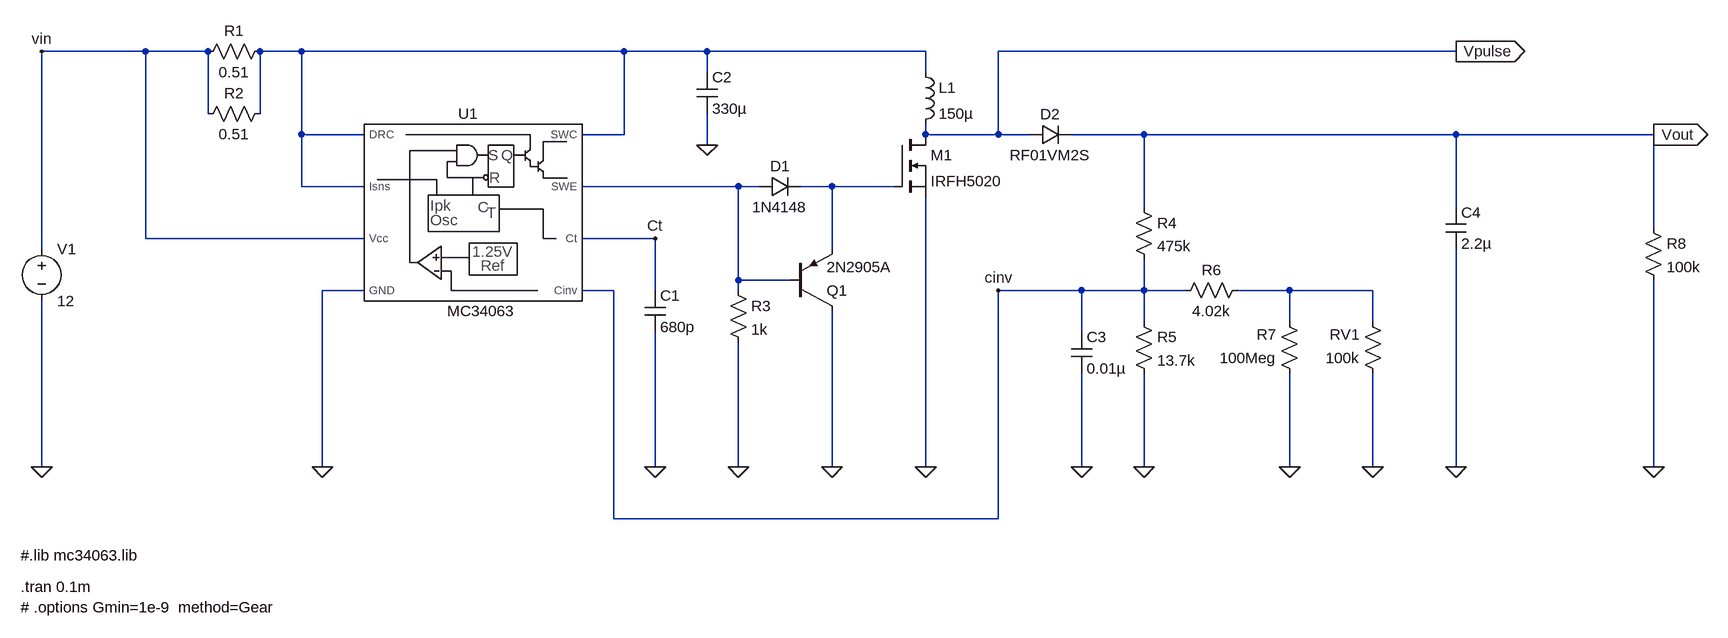
[diagram p0: schematic HV_PSU.asc]
HV_PSU.asc, the LTspice schematic file:
Version 4
SHEET 1 1968 696
WIRE -464 -176 -624 -176
WIRE -368 -176 -464 -176
WIRE -224 -176 -288 -176
WIRE 272 -176 -224 -176
WIRE 400 -176 272 -176
WIRE 736 -176 400 -176
WIRE 1552 -176 848 -176
WIRE 400 -144 400 -176
WIRE 736 -144 736 -176
WIRE -368 -80 -368 -176
WIRE -288 -80 -288 -176
WIRE -224 -48 -224 -176
WIRE -128 -48 -224 -48
WIRE 272 -48 272 -176
WIRE 272 -48 208 -48
WIRE 736 -48 736 -64
WIRE 848 -48 848 -176
WIRE 848 -48 736 -48
WIRE 896 -48 848 -48
WIRE 1072 -48 960 -48
WIRE 1552 -48 1072 -48
WIRE 1856 -48 1552 -48
WIRE 400 -32 400 -80
WIRE -224 32 -224 -48
WIRE -128 32 -224 32
WIRE 448 32 208 32
WIRE 480 32 448 32
WIRE 592 32 544 32
WIRE 688 32 592 32
WIRE 1072 64 1072 -48
WIRE 1552 64 1552 -48
WIRE 1856 96 1856 -48
WIRE -464 112 -464 -176
WIRE -128 112 -464 112
WIRE 320 112 208 112
WIRE -624 128 -624 -176
WIRE 592 128 592 32
WIRE 448 176 448 32
WIRE 528 176 448 176
WIRE -128 192 -192 192
WIRE 256 192 208 192
WIRE 320 192 320 112
WIRE 448 192 448 176
WIRE 976 192 848 192
WIRE 1072 192 1072 144
WIRE 1072 192 976 192
WIRE 1136 192 1072 192
WIRE 1296 192 1216 192
WIRE 1424 192 1296 192
WIRE 1072 240 1072 192
WIRE 1296 240 1296 192
WIRE 1424 240 1424 192
WIRE 976 256 976 192
WIRE -624 464 -624 208
WIRE -192 464 -192 192
WIRE 320 464 320 256
WIRE 448 464 448 272
WIRE 592 464 592 224
WIRE 736 464 736 48
WIRE 976 464 976 320
WIRE 1072 464 1072 320
WIRE 1296 464 1296 320
WIRE 1424 464 1424 320
WIRE 1552 464 1552 128
WIRE 1856 464 1856 176
WIRE 256 544 256 192
WIRE 848 544 848 192
WIRE 848 544 256 544
FLAG -192 464 0
FLAG 400 -32 0
FLAG 448 464 0
FLAG 320 464 0
FLAG 592 464 0
FLAG 736 464 0
FLAG 1072 464 0
FLAG 1296 464 0
FLAG 1424 464 0
FLAG 1552 464 0
FLAG 976 464 0
FLAG -624 464 0
FLAG 1856 -48 Vout
IOPIN 1856 -48 Out
FLAG 1552 -176 Vpulse
IOPIN 1552 -176 Out
FLAG 320 112 Ct
FLAG 848 192 cinv
FLAG -624 -176 vin
FLAG 1856 464 0
SYMBOL cap 304 192 R0
SYMATTR InstName C1
SYMATTR Value 680p
SYMBOL res -272 -192 R90
WINDOW 0 0 56 VBottom 2
WINDOW 3 32 56 VTop 2
SYMATTR InstName R1
SYMATTR Value 0.51
SYMBOL res -272 -96 R90
WINDOW 0 0 56 VBottom 2
WINDOW 3 32 56 VTop 2
SYMATTR InstName R2
SYMATTR Value 0.51
SYMBOL diode 480 48 R270
WINDOW 0 32 32 VTop 2
WINDOW 3 0 32 VBottom 2
SYMATTR InstName D1
SYMATTR Value 1N4148
SYMBOL cap 384 -144 R0
SYMATTR InstName C2
SYMATTR Value 330µ
SYMBOL ind 720 -160 R0
SYMATTR InstName L1
SYMATTR Value 150µ
SYMBOL pnp 528 224 M180
SYMATTR InstName Q1
SYMATTR Value 2N2905A
SYMBOL res 432 176 R0
SYMATTR InstName R3
SYMATTR Value 1k
SYMBOL nmos 688 -48 R0
SYMATTR InstName M1
SYMATTR Value IRFH5020
SYMBOL diode 896 -32 R270
WINDOW 0 32 32 VTop 2
WINDOW 3 0 32 VBottom 2
SYMATTR InstName D2
SYMATTR Value RF01VM2S
SYMBOL res 1056 48 R0
SYMATTR InstName R4
SYMATTR Value 475k
SYMBOL res 1056 224 R0
SYMATTR InstName R5
SYMATTR Value 13.7k
SYMBOL res 1232 176 R90
WINDOW 0 0 56 VBottom 2
WINDOW 3 32 56 VTop 2
SYMATTR InstName R6
SYMATTR Value 4.02k
SYMBOL res 1312 336 R180
WINDOW 0 36 76 Left 2
WINDOW 3 36 40 Left 2
SYMATTR InstName R7
SYMATTR Value 100Meg
SYMBOL res 1440 336 R180
WINDOW 0 36 76 Left 2
WINDOW 3 36 40 Left 2
SYMATTR InstName RV1
SYMATTR Value 100k
SYMBOL cap 1536 64 R0
SYMATTR InstName C4
SYMATTR Value 2.2µ
SYMBOL cap 960 256 R0
SYMATTR InstName C3
SYMATTR Value 0.01µ
SYMBOL voltage -624 112 R0
SYMATTR InstName V1
SYMATTR Value 12
SYMBOL res 1840 80 R0
SYMATTR InstName R8
SYMATTR Value 100k
SYMBOL mc34063 112 48 R0
SYMATTR InstName U1
TEXT -656 648 Left 2 !.tran 0.1m
TEXT -656 680 Left 2 !# .options Gmin=1e-9  method=Gear
TEXT -656 600 Left 2 !#.lib mc34063.lib

The netlist it stands for:
* HV_PSU.asc
C1 Ct 0 680p
R1 N001 vin 0.51
R2 N001 vin 0.51
D1 N002 N003 1N4148
C2 N001 0 330µ
L1 N001 Vpulse 150µ
Q1 0 N002 N003 0 2N2905A
R3 N002 0 1k
M1 Vpulse N003 0 0 IRFH5020
D2 Vpulse Vout RF01VM2S
R4 Vout cinv 475k
R5 cinv 0 13.7k
R6 N004 cinv 4.02k
R7 0 N004 100Meg
RV1 0 N004 100k
C4 Vout 0 2.2µ
C3 cinv 0 0.01µ
V1 vin 0 12
R8 Vout 0 100k
XU1 N001 N002 Ct 0 cinv vin N001 N001 MC34063  ; pins SWC SWE Ct GND Cinv Vcc Isns DRC
.model D D
.lib standard.dio
.model NPN NPN
.model PNP PNP
.lib standard.bjt
.model NMOS NMOS
.model PMOS PMOS
.lib standard.mos
.tran 0.1m
# .options Gmin=1e-9  method=Gear
#.lib mc34063.lib
.lib MC34063.sub
.backanno
.end